# EasyEDA schematic Line follower Atmega32u4 V4 - (MartijnBeele).json
TITLE: Line follower Atmega32u4; REV: 1.0; Date: 2018-10-03; Sheet: 1/1; Drawn By: MartijnBeele
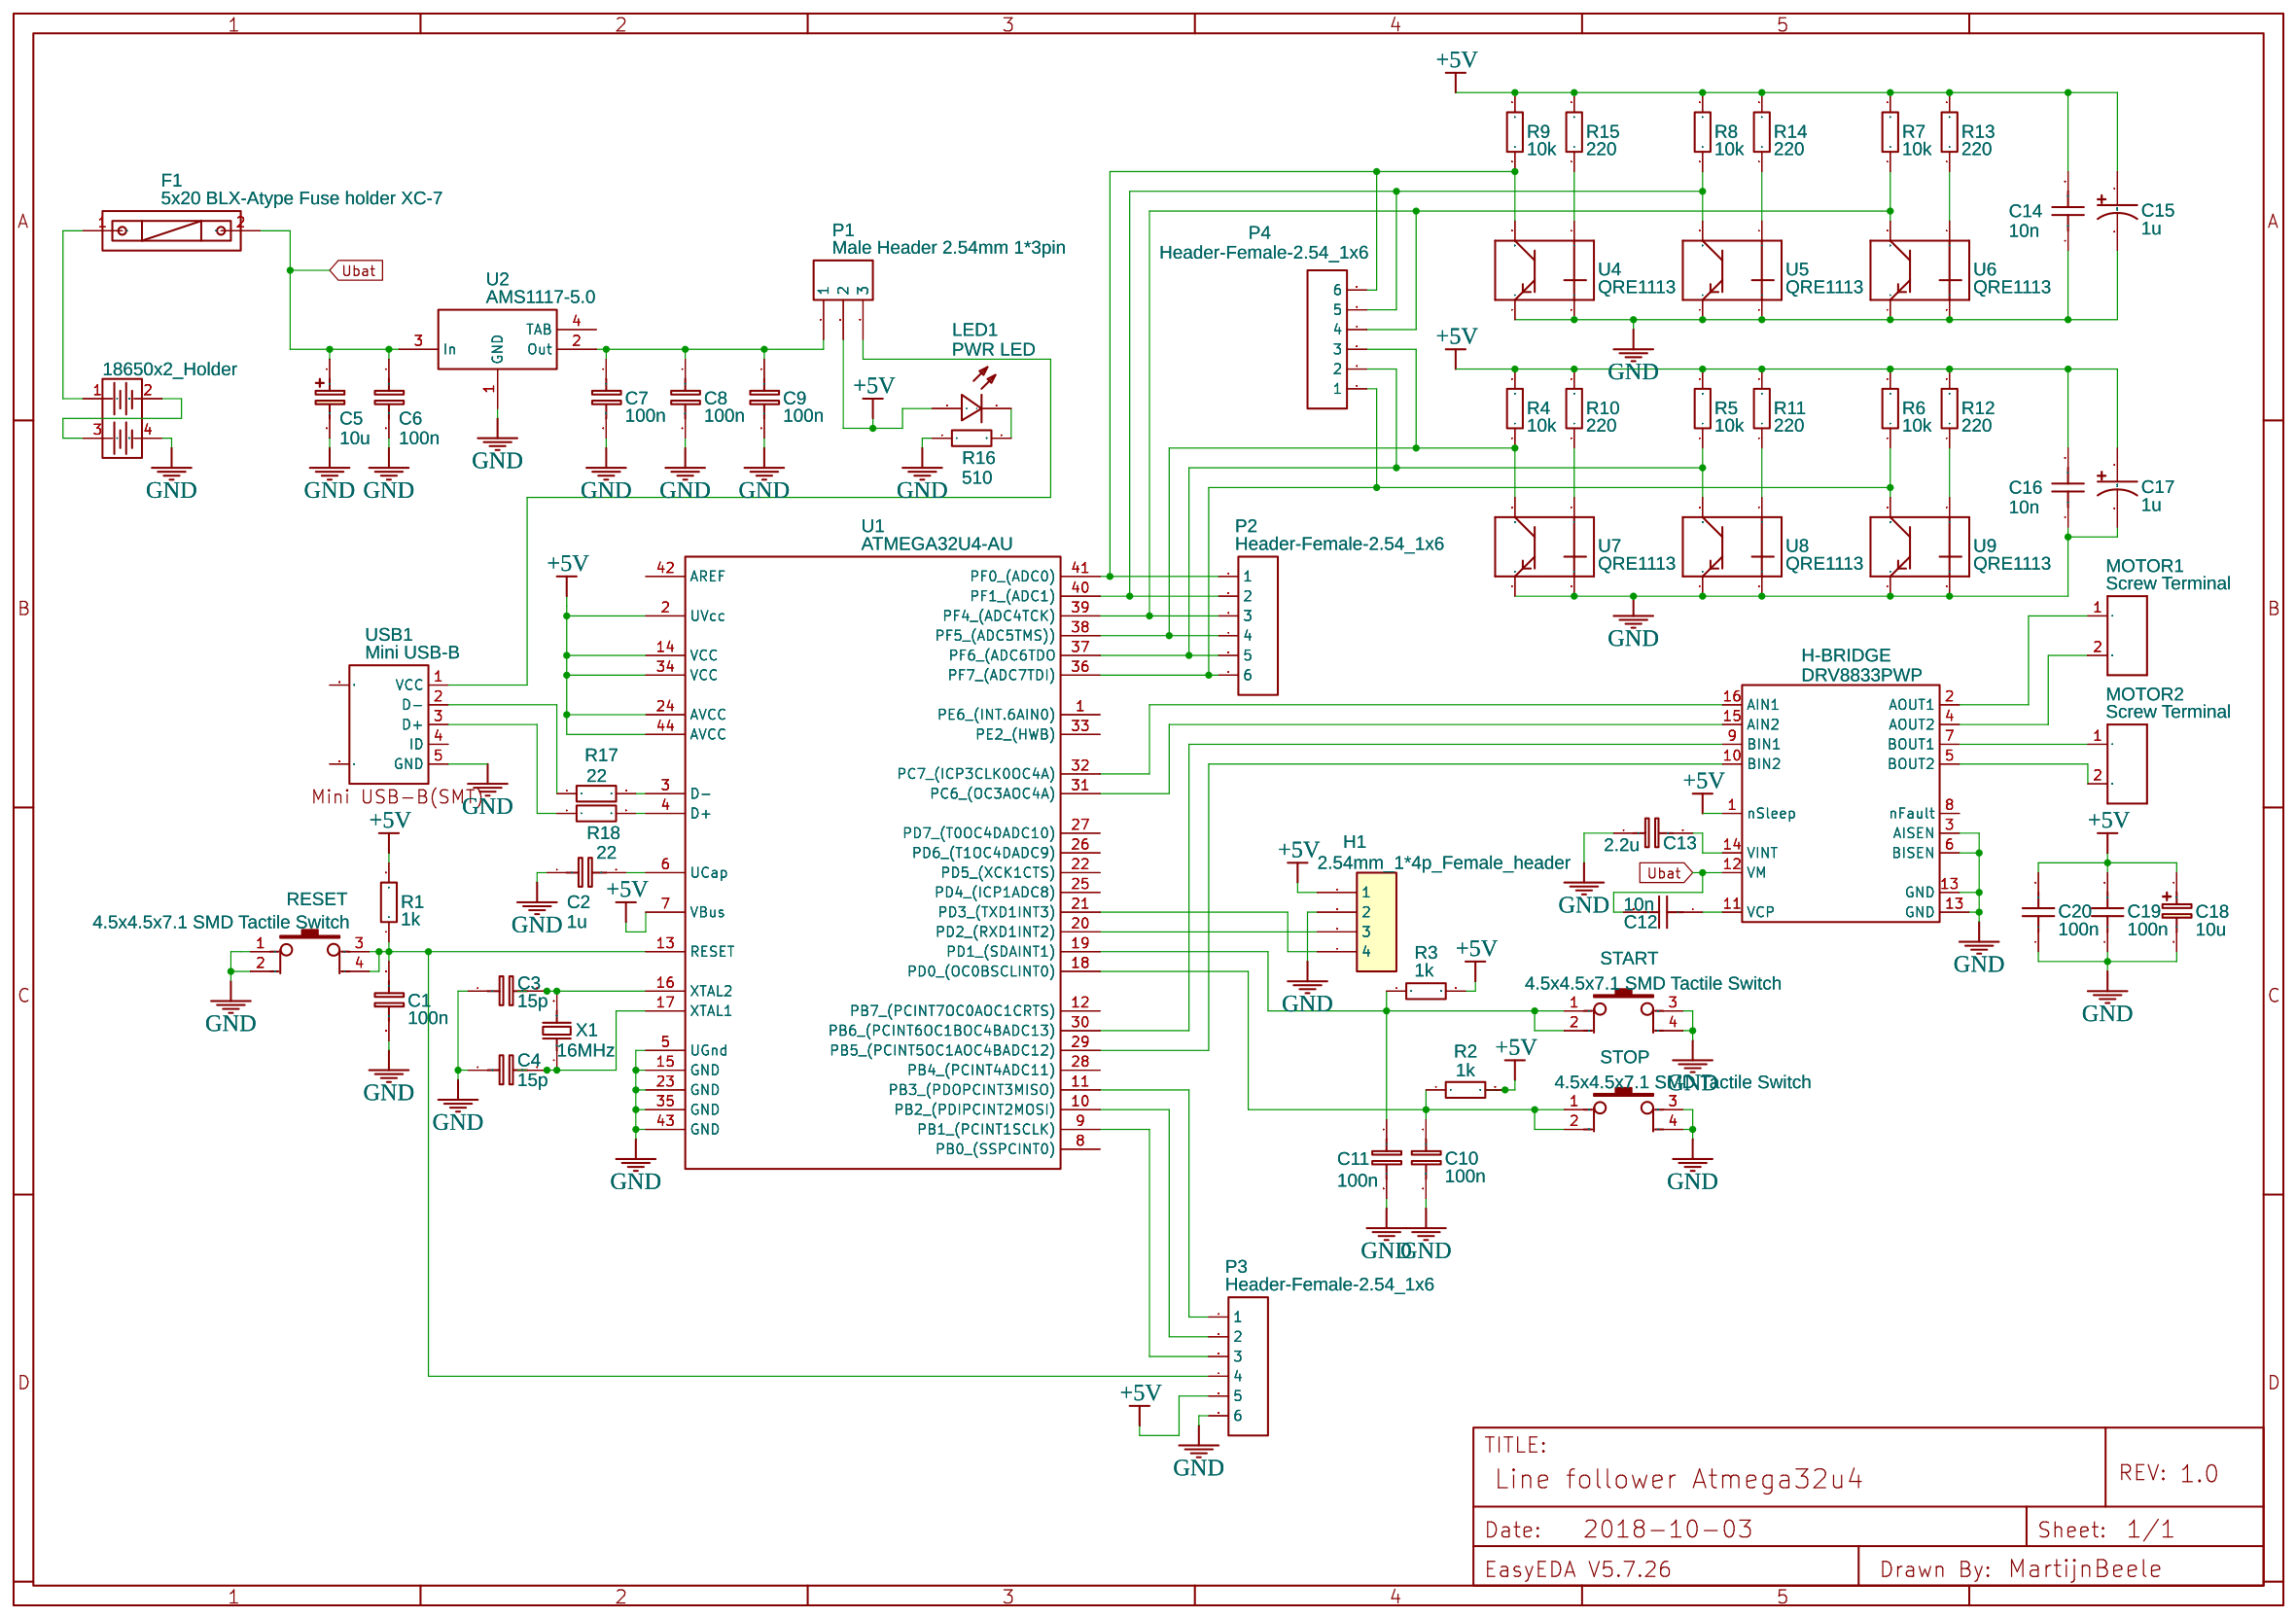
[diagram p0: schematic sheet]

## Parts
C1  100n  [1206]
C2  1u  [1206]
C3  15p  [1206]
C4  15p  [1206]
C5  10u  [1206]
C6  100n  [1206]
C7  100n  [1206]
C8  100n  [1206]
C9  100n  [1206]
C10  100n  [1206]
C11  100n  [1206]
C12  10n  [1206]
C13  2.2u  [1206]
C14  10n  [1206]
C15  1u  [1206]
C16  10n  [1206]
C17  1u  [1206]
C18  10u  [1206]
C19  100n  [1206]
C20  100n  [1206]
F1  5x20 BLX-Atype Fuse holder XC-7  [5X20-BLX-A]
H1  2.54mm_1*4p_Female_header  [HDR-4X1/2.54]
H-BRIDGE  DRV8833PWP  [TSSOP-16]
LED1  PWR LED  [0603]
MOTOR1  Screw Terminal  [H2-5.0-10.5X8.0MM]
MOTOR2  Screw Terminal  [H2-5.0-10.5X8.0MM]
P1  Male Header 2.54mm 1*3pin  [HDR-3X1/2.54]
P2  Header-Female-2.54_1x6  [HDR-6X1/2.54]
P3  Header-Female-2.54_1x6  [HDR-6X1/2.54]
P4  Header-Female-2.54_1x6  [HDR-6X1/2.54]
R1  1k  [1206]
R2  1k  [1206]
R3  1k  [1206]
R4  10k  [1206]
R5  10k  [1206]
R6  10k  [1206]
R7  10k  [1206]
R8  10k  [1206]
R9  10k  [1206]
R10  220  [1206]
R11  220  [1206]
R12  220  [1206]
R13  220  [1206]
R14  220  [1206]
R15  220  [1206]
R16  510  [1206]
R17  22  [AXIAL-0.3]
R18  22  [AXIAL-0.3]
RESET  4.5x4.5x7.1 SMD Tactile Switch  [KEY-4.5*4.5]
START  4.5x4.5x7.1 SMD Tactile Switch  [KEY-4.5*4.5]
STOP  4.5x4.5x7.1 SMD Tactile Switch  [KEY-4.5*4.5]
U1  ATMEGA32U4-AU  [QFP-44_10X10X08P]
U2  AMS1117-5.0  [SOT-223]
U3  18650x2_Holder  [18650_X2_HOLDER]
U4  QRE1113  [QRE1113]
U5  QRE1113  [QRE1113]
U6  QRE1113  [QRE1113]
U7  QRE1113  [QRE1113]
U8  QRE1113  [QRE1113]
U9  QRE1113  [QRE1113]
USB1  Mini USB-B  [MICRO-USB-13]
X1  16MHz  [HC-49SMD]

## Library data of the parts
C1-C4 C6-C11 C13 = Cap_RAD-0.1_EU: Manufacturer Part: ?
C5 C18 = Cap_Electrolytic(TH)_D3.0XF1.5_EU: Contributor: EasyEDA; Manufacturer Part: ?
C12 C14 C16 C19 C20 = Cap_RAD-0.1_US: Manufacturer Part: ?
C15 C17 = Cap_Electrolytic(TH)_D3.0XF1.5_US: Manufacturer Part: ?
F1 = -: Supplier: LCSC; Manufacturer: XCFuse; image: //image.lceda.cn/szlcsc/C3131.jpg; Contributor: LCSC; Supplier Part: C3131
H1 = -: Supplier Part: C50950; Supplier: LCSC; Manufacturer: BOOMELE; Manufacturer Part: 2.54mm 1*5p Female header; image: //image.lceda.cn/szlcsc/C50950.jpg; Contributor: speedbird
H-BRIDGE = -: Supplier: LCSC; Manufacturer: TI; image: //image.lceda.cn/szlcsc/C50506.jpg; Contributor: LCSC; Supplier Part: C50506
LED1 = -: Supplier Part: C99772; Supplier: LCSC; Manufacturer: EVERLIGHT; Manufacturer Part: 204-10SURD/S530-A3
MOTOR1 MOTOR2 = -: Manufacturer Part: ?
P1 = -: Supplier Part: C49257; Supplier: LCSC; Manufacturer: BOOMELE; Manufacturer Part: Header2.54mm 1*3P; image: //image.lceda.cn/szlcsc/C49257.jpg
P2-P4 = -: Supplier: LCSC; Manufacturer: BOOMELE; Manufacturer Part: Female header 1*6p; Contributor: LCSC; Supplier Part: C40877
R1-R18 = Res_AXIAL-0.3(1/8W)_EU: Manufacturer Part: ?
RESET START STOP = -: Supplier: LCSC; Manufacturer: ReliaPro; image: //image.lceda.cn/szlcsc/C28777.jpg; Contributor: LCSC; Supplier Part: C28777
U1 = -: Supplier: LCSC; Manufacturer: MICROCHIP; image: //image.lceda.cn/szlcsc/C44854.jpg; Contributor: LCSC; Supplier Part: C44854
U2 = -: sourceId: HltLFyQwq; Supplier: LCSC; Manufacturer: AMS; LCSC Assembly: Yes; image: //image.lceda.cn/szlcsc/C6187.jpg; Contributor: LCSC; Supplier Part: C6187
U3 = -: Manufacturer Part: New SchematicLib; Contributor: lysergicenemy
U4-U9 = -: Contributor: SparkFun; Manufacturer Part: ?
USB1 = -: Supplier: LCSC; Manufacturer: ValuePro; Manufacturer Part: MINI 5PMOTHERBOARD COPPER SHELL WITH COLUMN LCPVINYL WITH HIGH TEMPERATURE GLUE; Contributor: LCSC; Supplier Part: C105424
X1 = 9C1602LCSC-BBK2S: Supplier: LCSC; Manufacturer: TXC; Contributor: LCSC; Supplier Part: C90940

## Nets
+5V: C14.2 C15.1 C16.2 C17.1 C18.1 C19.2 C20.2 H1.1 H-BRIDGE.1(nSleep) LED1.1(+) P1.2 P3.5 R1.2 R2.2 R3.2 R4.2 R5.2 R6.2 R7.2 R8.2 R9.2 R10.2 R11.2 R12.2 R13.2 R14.2 R15.2 U1.2(UVcc) U1.7(VBus) U1.14(VCC) U1.24(AVCC) U1.34(VCC) U1.44(AVCC)
GND: C1.2 C2.1 C3.1 C4.1 C5.2 C6.2 C7.2 C8.2 C9.2 C10.2 C11.2 C13.1 C14.1 C15.2 C16.1 C17.2 C18.2 C19.1 C20.1 H1.2 H-BRIDGE.3(AISEN) H-BRIDGE.6(BISEN) H-BRIDGE.13(GND) P3.6 R16.1 RESET.1 RESET.2 START.3 START.4 STOP.3 STOP.4 U1.5(UGnd) U1.15(GND) U1.23(GND) U1.35(GND) U1.43(GND) U2.1(GND) U3.4(2) U4.2(K) U4.4(E) U5.2(K) U5.4(E) U6.2(K) U6.4(E) U7.2(K) U7.4(E) U8.2(K) U8.4(E) U9.2(K) U9.4(E) USB1.5(GND)
Ubat: C5.1 C6.1 C12.2 F1.2 H-BRIDGE.12(VM) U2.3(In)
Net-(C1-1): C1.1 P3.4 R1.1 RESET.3 RESET.4 U1.13(RESET)
Net-(C2-2): C2.2 U1.6(UCap)
Net-(C3-2): C3.2 U1.16(XTAL2) X1.2
Net-(C4-2): C4.2 U1.17(XTAL1) X1.1
Net-(C7-1): C7.1 C8.1 C9.1 P1.1 U2.2(Out)
Net-(C10-1): C10.1 R2.1 STOP.1 STOP.2 U1.18(PD0 (OC0BSCLINT0))
Net-(C11-1): C11.1 R3.1 START.1 START.2 U1.19(PD1 (SDAINT1))
Net-(C12-1): C12.1 H-BRIDGE.11(VCP)
Net-(C13-2): C13.2 H-BRIDGE.14(VINT)
Net-(F1-1): F1.1 U3.1
Net-(H1-3): H1.3 U1.20(PD2 (RXD1INT2))
Net-(H1-4): H1.4 U1.21(PD3 (TXD1INT3))
Net-(H-BRIDGE-2): H-BRIDGE.2(AOUT1) MOTOR1.1
Net-(H-BRIDGE-4): H-BRIDGE.4(AOUT2) MOTOR1.2
Net-(H-BRIDGE-5): H-BRIDGE.5(BOUT2) MOTOR2.2
Net-(H-BRIDGE-7): H-BRIDGE.7(BOUT1) MOTOR2.1
Net-(H-BRIDGE-9): H-BRIDGE.9(BIN1) U1.30(PB6 (PCINT6OC1BOC4BADC13))
Net-(H-BRIDGE-10): H-BRIDGE.10(BIN2) U1.29(PB5 (PCINT5OC1AOC4BADC12))
Net-(H-BRIDGE-15): H-BRIDGE.15(AIN2) U1.31(PC6 (OC3AOC4A))
Net-(H-BRIDGE-16): H-BRIDGE.16(AIN1) U1.32(PC7 (ICP3CLK0OC4A))
Net-(LED1-2): LED1.2(-) R16.2
Net-(P1-3): P1.3 USB1.1(VCC)
Net-(P2-1): P2.1 P4.6 R9.1 U1.41(PF0 (ADC0)) U4.3(C)
Net-(P2-2): P2.2 P4.5 R8.1 U1.40(PF1 (ADC1)) U5.3(C)
Net-(P2-3): P2.3 P4.4 R7.1 U1.39(PF4 (ADC4TCK)) U6.3(C)
Net-(P2-4): P2.4 P4.3 R4.1 U1.38(PF5 (ADC5TMS))) U7.3(C)
Net-(P2-5): P2.5 P4.2 R5.1 U1.37(PF6 (ADC6TDO) U8.3(C)
Net-(P2-6): P2.6 P4.1 R6.1 U1.36(PF7 (ADC7TDI)) U9.3(C)
Net-(P3-1): P3.1 U1.11(PB3 (PDOPCINT3MISO))
Net-(P3-2): P3.2 U1.10(PB2 (PDIPCINT2MOSI))
Net-(P3-3): P3.3 U1.9(PB1 (PCINT1SCLK))
Net-(R10-1): R10.1 U7.1(A)
Net-(R11-1): R11.1 U8.1(A)
Net-(R12-1): R12.1 U9.1(A)
Net-(R13-1): R13.1 U6.1(A)
Net-(R14-1): R14.1 U5.1(A)
Net-(R15-1): R15.1 U4.1(A)
Net-(R17-1): R17.1 USB1.2(D-)
Net-(R17-2): R17.2 U1.3(D-)
Net-(R18-1): R18.1 USB1.3(D+)
Net-(R18-2): R18.2 U1.4(D+)
Net-(U3-2): U3.2 U3.3(1)

Not connected (* = marked no-connect by the designer): H-BRIDGE 8(nFault); U1 1(PE6 (INT.6AIN0)) 8(PB0 (SSPCINT0)) 12(PB7 (PCINT7OC0AOC1CRTS)) 22(PD5 (XCK1CTS)) 25(PD4 (ICP1ADC8)) 26(PD6 (T1OC4DADC9)) 27(PD7 (T0OC4DADC10)) 28(PB4 (PCINT4ADC11)) 33(PE2 (HWB)) 42(AREF); U2 4(TAB); USB1 0 4(ID)
